# Altium schematic sheet Robot.SchDoc
size A4; SheetNumber: 1; SheetTotal: 6
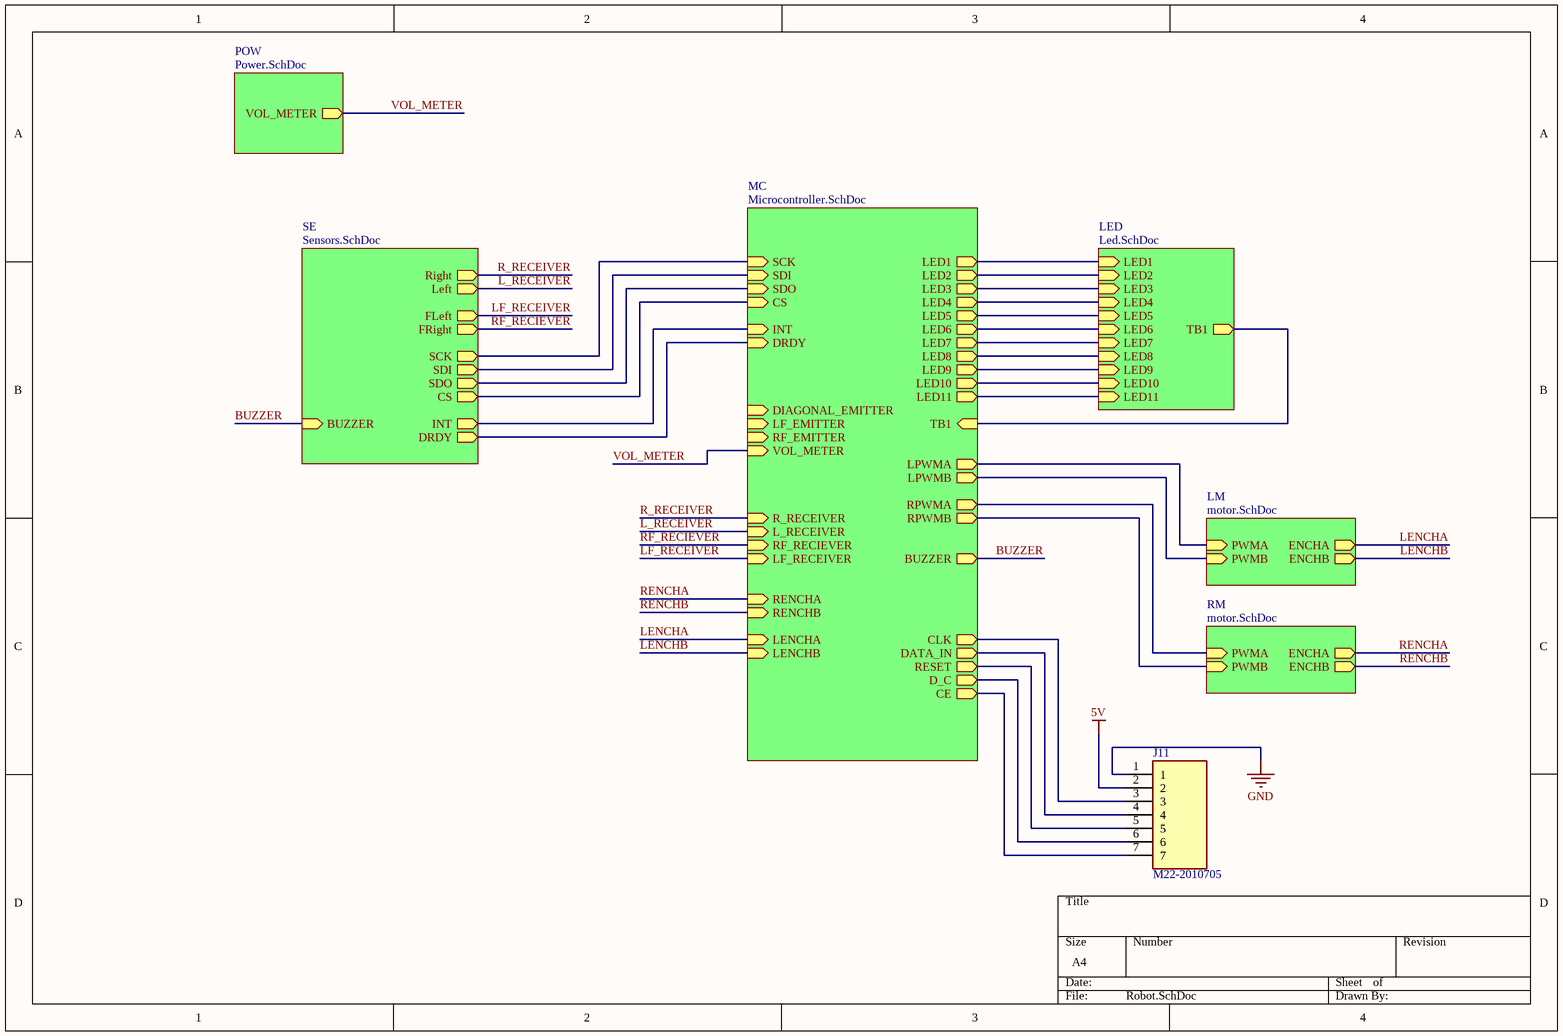
[diagram p0: Robot.SchDoc]

## Parts
J11  M22-2010705  [HDRV7W50P0X200_1X7_1400X200X545P]

## Sub-sheets
LED = Led.SchDoc: LED7 (in), LED9 (in), LED8 (in), LED4 (in), LED11 (in), TB1 (out), LED5 (in), LED10 (in), LED6 (in), LED1 (in), LED2 (in), LED3 (in)
LM = motor.SchDoc: ENCHA (out), PWMB (in), ENCHB (out), PWMA (in)
MC = Microcontroller.SchDoc: LED6 (out), INT (in), RPWMB (out), LED9 (out), LPWMB (out), LPWMA (out), LED11 (out), RPWMA (out), LED1 (out), CS (in), DRDY (in), R_RECEIVER (in), LED5 (out), DIAGONAL_EMITTER (in), SDI (in), TB1 (in), LED10 (out), LED2 (out), LED4 (out), LED3 (out), SCK (in), LED8 (out), L_RECEIVER (in), RENCHB (in), LENCHB (in), LED7 (out), LENCHA (in), LF_EMITTER (in), RENCHA (in), BUZZER (out), SDO (in), RF_EMITTER (in), RF_RECIEVER (in), LF_RECEIVER (in), D_C (out), CE (out), RESET (out), CLK (out), DATA_IN (out), VOL_METER (in)
POW = Power.SchDoc: VOL_METER (out)
RM = motor.SchDoc: ENCHA (out), PWMB (in), ENCHB (out), PWMA (in)
SE = Sensors.SchDoc: Right (out), FLeft (out), FRight (out), Left (out), BUZZER (in), SDO (out), CS (out), DRDY (out), INT (out), SDI (out), SCK (out)

## Nets
5V: J11.2
GND: J11.1
BUZZER: sheet MC/BUZZER, sheet SE/BUZZER
L_RECEIVER: sheet MC/L_RECEIVER, sheet SE/Left
LENCHA: sheet MC/LENCHA, sheet LM/ENCHA
LENCHB: sheet MC/LENCHB, sheet LM/ENCHB
LF_RECEIVER: sheet MC/LF_RECEIVER, sheet SE/FLeft
R_RECEIVER: sheet MC/R_RECEIVER, sheet SE/Right
RENCHA: sheet MC/RENCHA, sheet RM/ENCHA
RENCHB: sheet MC/RENCHB, sheet RM/ENCHB
RF_RECIEVER: sheet MC/RF_RECIEVER, sheet SE/FRight
VOL_METER: sheet MC/VOL_METER, sheet POW/VOL_METER
NetJ11_3: J11.3 ; sheet MC/CLK
NetJ11_4: J11.4 ; sheet MC/DATA_IN
NetJ11_5: J11.5 ; sheet MC/RESET
NetJ11_6: J11.6 ; sheet MC/D_C
NetJ11_7: J11.7 ; sheet MC/CE
(unnamed): sheet MC/LED6, sheet LED/LED6
(unnamed): sheet MC/INT, sheet SE/INT
(unnamed): sheet MC/RPWMB, sheet RM/PWMB
(unnamed): sheet MC/LED9, sheet LED/LED9
(unnamed): sheet MC/LPWMB, sheet LM/PWMB
(unnamed): sheet MC/LPWMA, sheet LM/PWMA
(unnamed): sheet MC/LED11, sheet LED/LED11
(unnamed): sheet MC/RPWMA, sheet RM/PWMA
(unnamed): sheet MC/LED1, sheet LED/LED1
(unnamed): sheet MC/CS, sheet SE/CS
(unnamed): sheet MC/DRDY, sheet SE/DRDY
(unnamed): sheet MC/LED5, sheet LED/LED5
(unnamed): sheet MC/SDI, sheet SE/SDI
(unnamed): sheet MC/TB1, sheet LED/TB1
(unnamed): sheet MC/LED10, sheet LED/LED10
(unnamed): sheet MC/LED2, sheet LED/LED2
(unnamed): sheet MC/LED4, sheet LED/LED4
(unnamed): sheet MC/LED3, sheet LED/LED3
(unnamed): sheet MC/SCK, sheet SE/SCK
(unnamed): sheet MC/LED8, sheet LED/LED8
(unnamed): sheet MC/LED7, sheet LED/LED7
(unnamed): sheet MC/SDO, sheet SE/SDO

## Library data of the parts
J11 = M22-2010705: Connector; Manufacturer_Name: Harwin; Datasheet Link: https://cdn.harwin.com/pdfs/M22-201.pdf; Height: 5.45mm; Manufacturer_Part_Number: M22-2010705; Mouser Part Number: 855-M22-2010705; Mouser Price/Stock: https://www.mouser.co.uk/ProductDetail/Harwin/M22-2010705?qs=xxdqPuaJ%252Ba0YL7fvtvtpQA%3D%3D